# EAGLE design YAKS2-TITUO.R02.1 (EAGLE 9.1.3)
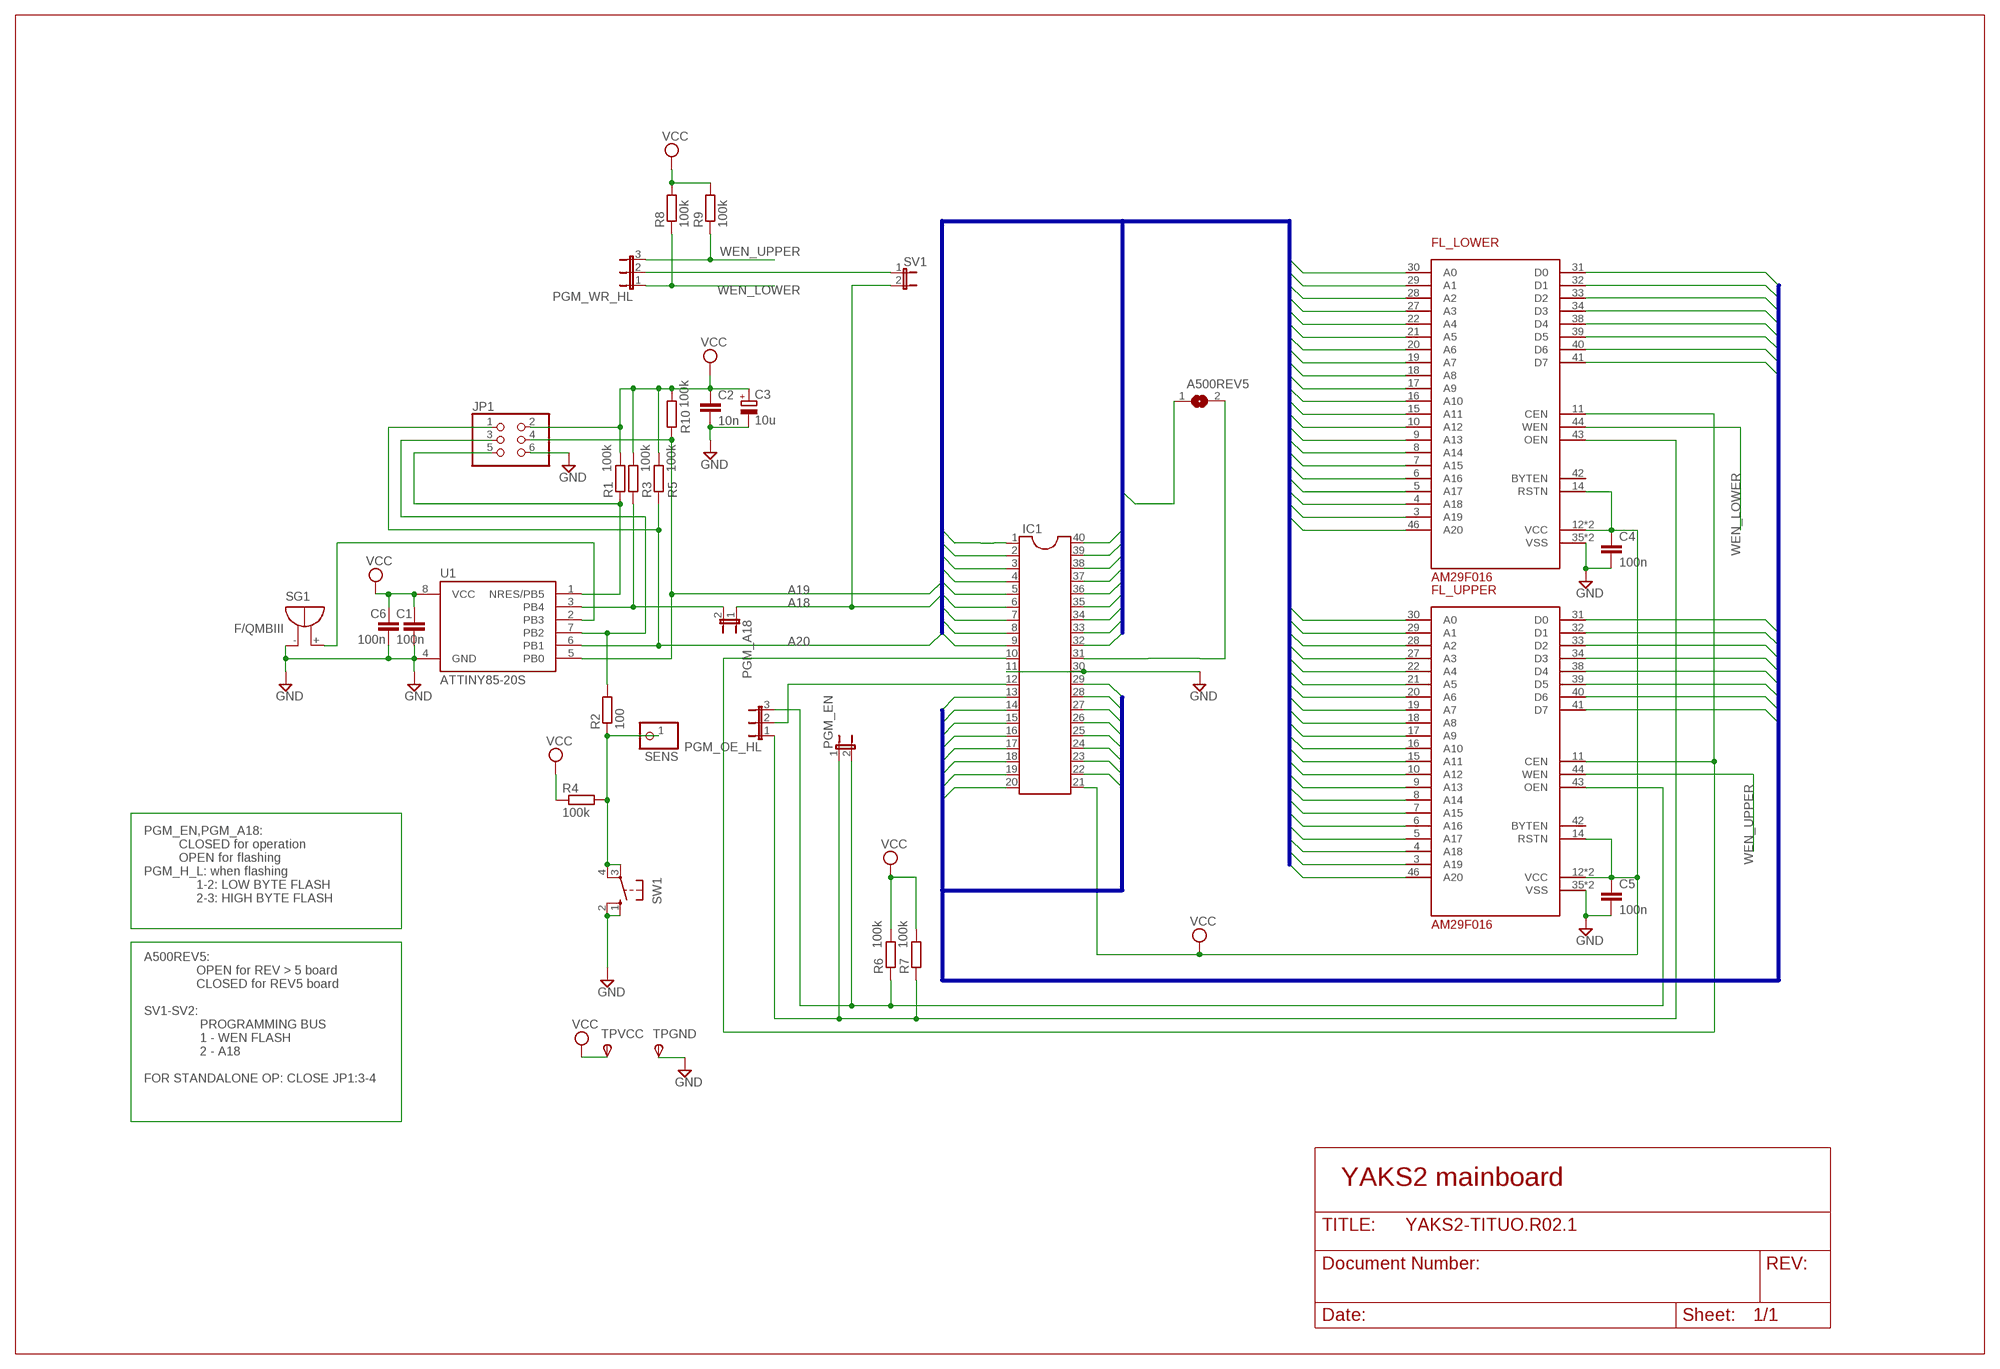
[diagram p0: schematic, sheet 1]

## Parts
A500REV5  SJ  [SJ]
C1  100n  C-EUC0805  [C0805]
C2  10n  C-EUC0805K  [C0805K]
C3  10u  CPOL-EUB/3528-21R  [B/3528-21R]
C4  100n  C-EUC0805  [C0805]
C5  100n  C-EUC0805  [C0805]
C6  100n  C-EUC0805  [C0805]
FL_LOWER  AM29F016  [TSOP48]
FL_UPPER  AM29F016  [TSOP48]
IC1  DIL40  [DIL40]
JP1  PINHD-2X3  [2X03]
PGM_A18  JP1E  [JP1]
PGM_EN  JP1E  [JP1]
PGM_OE_HL  JP2E  [JP2]
PGM_WR_HL  JP2E  [JP2]
R1  100k  R-EU_M0805  [M0805]
R2  100  R-EU_M0805  [M0805]
R3  100k  R-EU_M0805  [M0805]
R4  100k  R-EU_M0805  [M0805]
R5  100k  R-EU_M0805  [M0805]
R6  100k  R-EU_M0805  [M0805]
R7  100k  R-EU_M0805  [M0805]
R8  100k  R-EU_M0805  [M0805]
R9  100k  R-EU_M0805  [M0805]
R10  100k  R-EU_M0805  [M0805]
SENS  PINHD-1X1  [1X01]
SG1  F/QMBIII  [F/QMBIII]
SV1  JP1E  [JP1]
SW1  10-XX  [B3F-10XX]
TPGND  TPSPAD1-13  [P1-13]
TPVCC  TPSPAD1-13  [P1-13]
U1  ATTINY85-20S  [SOIC8_EIAJ_208MIL]

## Nets
A0: FL_LOWER.30(A0) FL_UPPER.30(A0) IC1.9
A1: FL_LOWER.29(A1) FL_UPPER.29(A1) IC1.8
A2: FL_LOWER.28(A2) FL_UPPER.28(A2) IC1.7
A3: FL_LOWER.27(A3) FL_UPPER.27(A3) IC1.6
A4: FL_LOWER.22(A4) FL_UPPER.22(A4) IC1.5
A5: FL_LOWER.21(A5) FL_UPPER.21(A5) IC1.4
A6: FL_LOWER.20(A6) FL_UPPER.20(A6) IC1.3
A7: FL_LOWER.19(A7) FL_UPPER.19(A7) IC1.2
A8: FL_LOWER.18(A8) FL_UPPER.18(A8) IC1.40
A9: FL_LOWER.17(A9) FL_UPPER.17(A9) IC1.39
A10: FL_LOWER.16(A10) FL_UPPER.16(A10) IC1.38
A11: FL_LOWER.15(A11) FL_UPPER.15(A11) IC1.37
A12: FL_LOWER.10(A12) FL_UPPER.10(A12) IC1.36
A13: FL_LOWER.9(A13) FL_UPPER.9(A13) IC1.35
A14: FL_LOWER.8(A14) FL_UPPER.8(A14) IC1.34
A15: FL_LOWER.7(A15) FL_UPPER.7(A15) IC1.33
A16: FL_LOWER.6(A16) FL_UPPER.6(A16) IC1.32
A17: A500REV5.1 FL_LOWER.5(A17) FL_UPPER.5(A17) IC1.1
A18: FL_LOWER.4(A18) FL_UPPER.4(A18) PGM_A18.1 SV1.2
A19: FL_LOWER.3(A19) FL_UPPER.3(A19) JP1.4 R10.1 U1.5(PB0)
A20: FL_LOWER.46(A20) FL_UPPER.46(A20) JP1.1 R5.1 U1.6(PB1)
BUZZ: SG1.+(-) U1.2(PB3)
D0: FL_LOWER.31(D0) IC1.13
D1: FL_LOWER.32(D1) IC1.15
D2: FL_LOWER.33(D2) IC1.17
D3: FL_LOWER.34(D3) IC1.19
D4: FL_LOWER.38(D4) IC1.22
D5: FL_LOWER.39(D5) IC1.24
D6: FL_LOWER.40(D6) IC1.26
D7: FL_LOWER.41(D7) IC1.28
D8: FL_UPPER.31(D0) IC1.14
D9: FL_UPPER.32(D1) IC1.16
D10: FL_UPPER.33(D2) IC1.18
D11: FL_UPPER.34(D3) IC1.20
D12: FL_UPPER.38(D4) IC1.23
D13: FL_UPPER.39(D5) IC1.25
D14: FL_UPPER.40(D6) IC1.27
D15: FL_UPPER.41(D7) IC1.29
GND: C1.2 C2.2 C3.- C4.2 C5.2 C6.2 FL_LOWER.35(VSS) FL_LOWER.36(VSS) FL_UPPER.35(VSS) FL_UPPER.36(VSS) IC1.11 IC1.30 JP1.6 SG1.-(+) SW1.1(S) SW1.2(S1) TPGND.TP(PP) U1.4(GND)
N$1: JP1.5 R1.1 U1.1(NRES/PB5)
N$2: PGM_WR_HL.2 SV1.1
N$3: A500REV5.2 IC1.31
N$6: R2.1 R4.2 SENS.1 SW1.3(P) SW1.4(P1)
N$7: IC1.12 PGM_OE_HL.2
N$15: PGM_A18.2 R3.1 U1.3(PB4)
OEN_LOWER: FL_LOWER.43(OEN) PGM_EN.1 PGM_OE_HL.1 R7.1
OEN_UPPER: FL_UPPER.43(OEN) PGM_EN.2 PGM_OE_HL.3 R6.1
ROM_ENABLE: FL_LOWER.11(CEN) FL_UPPER.11(CEN) IC1.10
SCK/PB2: JP1.3 R2.2 U1.7(PB2)
VCC: C1.1 C2.1 C3.+ C4.1 C5.1 C6.1 FL_LOWER.12(VCC) FL_LOWER.14(RSTN) FL_LOWER.37(VCC) FL_UPPER.12(VCC) FL_UPPER.14(RSTN) FL_UPPER.37(VCC) IC1.21 JP1.2 R1.2 R3.2 R4.1 R5.2 R6.2 R7.2 R8.2 R9.2 R10.2 TPVCC.TP(PP) U1.8(VCC)
WEN_LOWER: FL_LOWER.44(WEN) PGM_WR_HL.1 R8.1
WEN_UPPER: FL_UPPER.44(WEN) PGM_WR_HL.3 R9.1
Unconnected: FL_LOWER.42(BYTEN) FL_UPPER.42(BYTEN)

## Buses
A[0..20]
D[0..15]

## Notes on the sheet
- PGM_EN,PGM_A18: 
            CLOSED for operation 
            OPEN for flashing
  PGM_H_L: when flashing
                 1-2: LOW BYTE FLASH
                 2-3: HIGH BYTE FLASH
- A500REV5: 
                 OPEN for REV > 5 board
                 CLOSED for REV5 board
  
  SV1-SV2:
                  PROGRAMMING BUS
                  1 - WEN FLASH
                  2 - A18
  
  FOR STANDALONE OP: CLOSE JP1:3-4
- YAKS2 mainboard

## Library data of the parts
A500REV5 = jumper:SJ: SMD solder JUMPER
C1 C2 C4-C6 = resistor:C-EU: CAPACITOR, European symbol
C3 = rcl:CPOL-EU: POLARIZED CAPACITOR, European symbol; SPICEPREFIX: C
FL_LOWER FL_UPPER = flashmemory:AM29F016
IC1 = ic-package:DIL40: Dual In Line
JP1 = pinhead:PINHD-2X3: PIN HEADER
PGM_A18 PGM_EN SV1 = jumper:JP1E: JUMPER
PGM_OE_HL PGM_WR_HL = jumper:JP2E: JUMPER
R1-R10 = resistor:R-EU_: RESISTOR, European symbol
SENS = pinhead:PINHD-1X1: PIN HEADER
SG1 = buzzer:F/QMBIII: BUZZER Source: Buerklin; OC_FARNELL: unknown; OC_NEWARK: unknown
SW1 = buttons:10-XX: OMRON SWITCH
TPGND TPVCC = testpad:TPS: TEST PIN
U1 = _hhn_attiny25_45_85:ATTINY85*: ATMEL ATtiny 85 Packages: P = PDIP 08 30mil S = SOIC 08 EIAJ 208mil Technologies Note: for complete ordering code (temp. range, finish, tape&reel etc.) see www.atmel.com • Supply Voltage: V = (1.8…5.5)V | [blank] = (2.7…5.5)V • Speed: 10 = 10 MHz | 20 = 20 MHz Author: Dipl.-Ing. FH Rainer Bayer HHN Hochschule Heilbronn (Heilbronn University), rainer.bayer@hs-heilbronn.de Ingenieurbüro ing-rb, mail@ing-rb.de

## Board
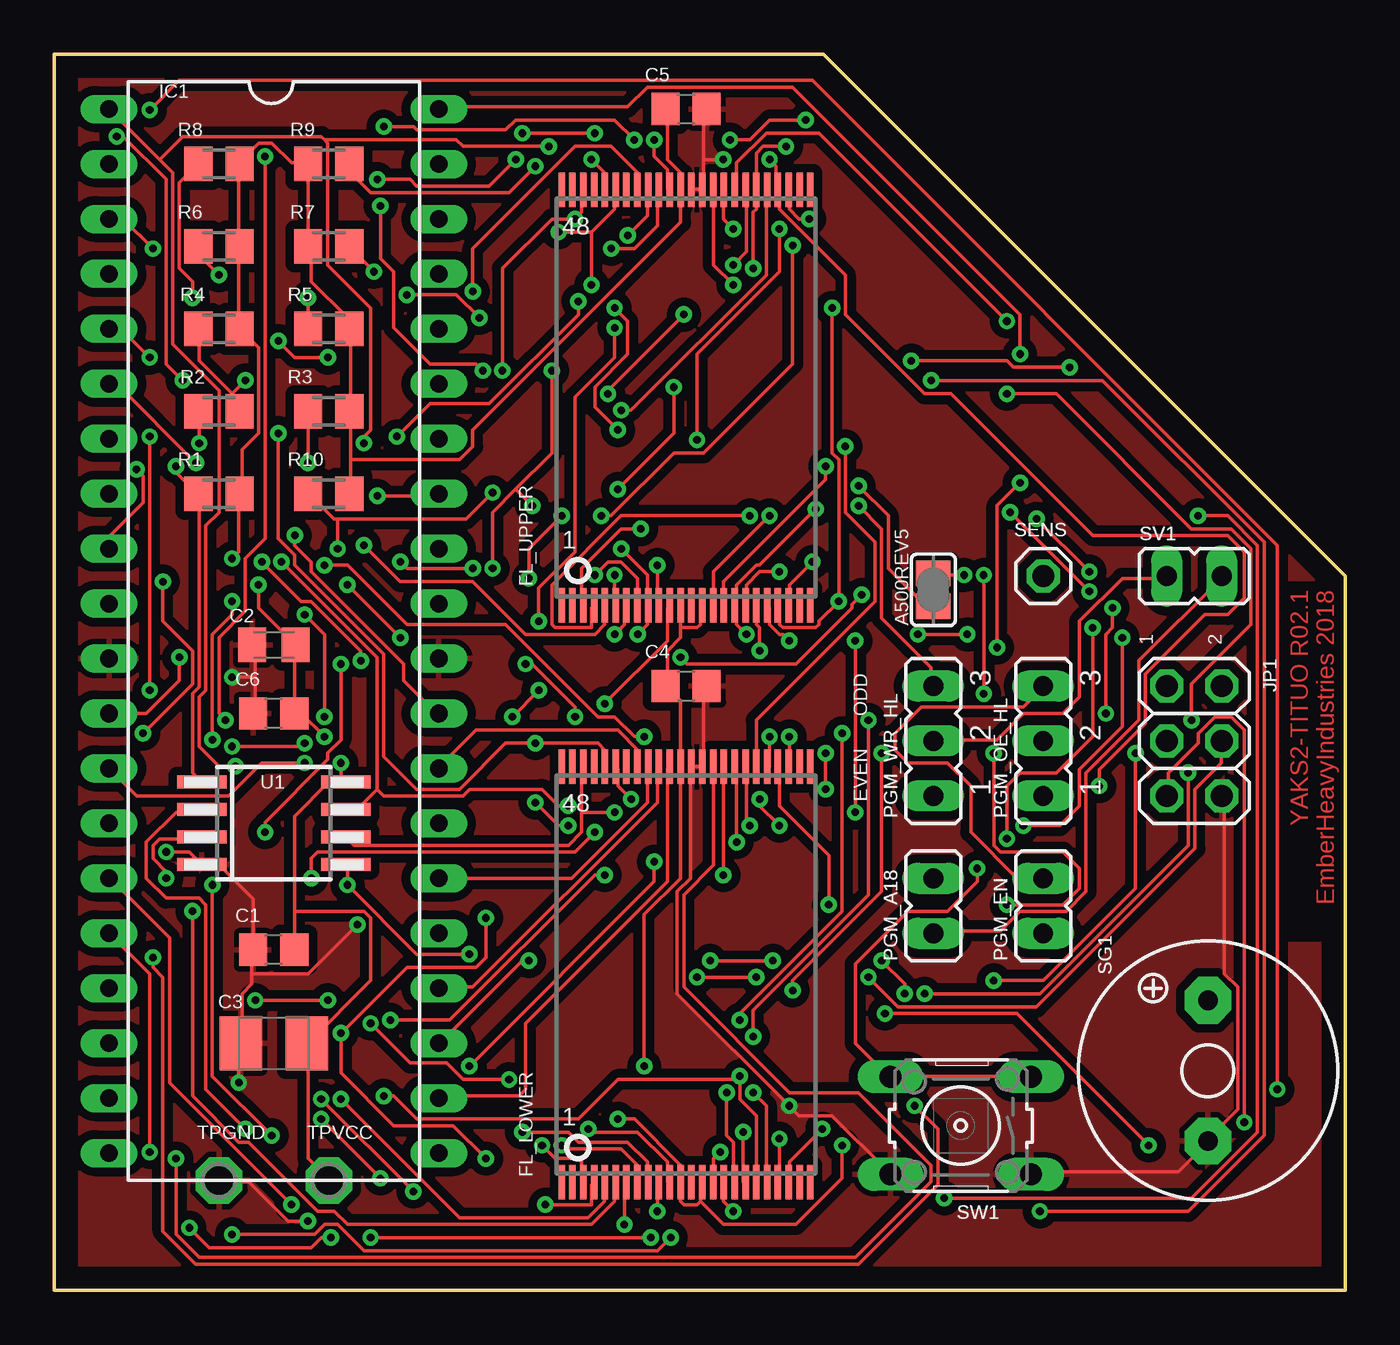
[diagram p1: board, top side]
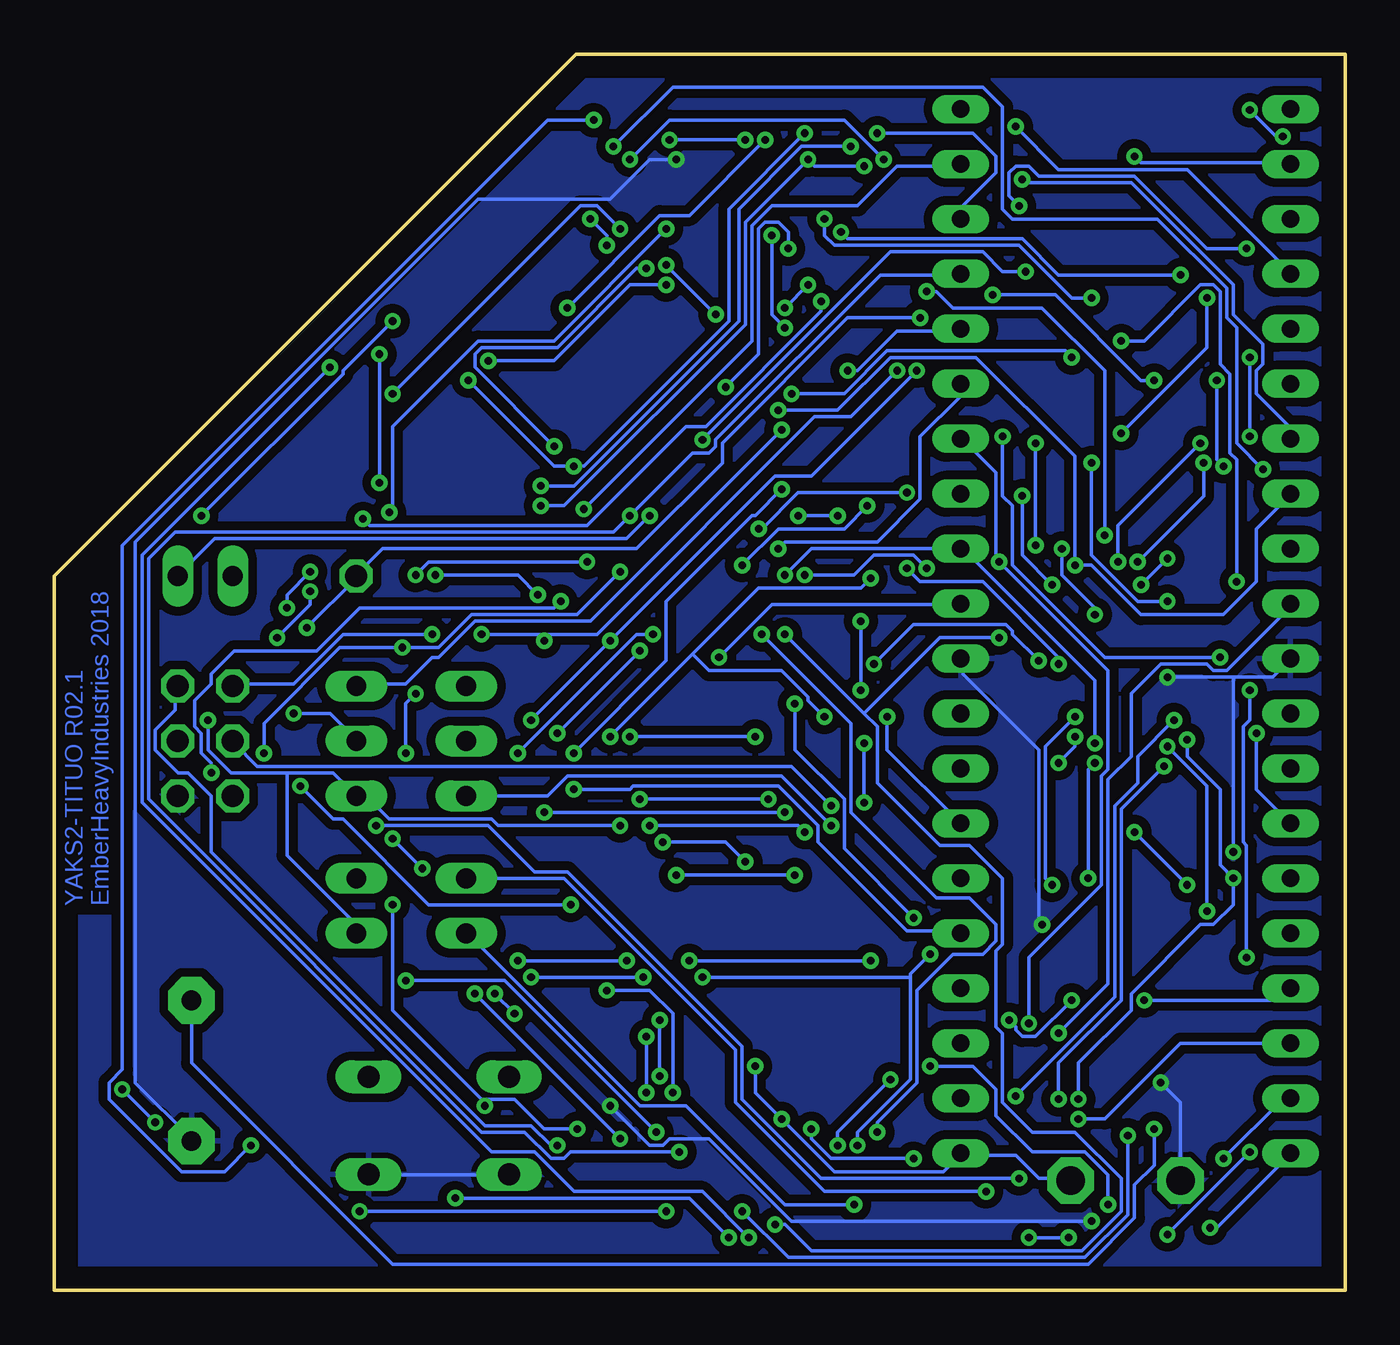
[diagram p2: board, bottom side, seen from below]

Size 59.69 x 57.15 mm. Coordinates in mm from the lower left corner, seen from the top.
Outline: 0,0 0,57.15 35.56,57.15 59.69,33.02 59.69,0 0,0
Copper layers (1*16): Top 0.035mm / dielectric 1.5mm / Bottom 0.035mm
Design rules "default": minimum track width 6mil, minimum drill 0.35mm, track to track 6mil, track to pad 6mil, pad to pad 6mil, via to via 6mil, smd to smd 6mil, copper to edge 40mil, drill to drill 6mil, minimum pad ring 10mil, minimum via ring 8mil, stop-mask expansion 4mil, vias tented up to drill 0mil, thermal gap 10mil

### Footprints (pad centres in the part's own frame; a part is rotated, then mirrored left to right if it is on the bottom)
SJ = smd 1.168 x 1.6: 1 -0.762,0; 2 0.762,0
C0805 = smd 1.3 x 1.5: 1 -0.95,0; 2 0.95,0
C0805K = smd 1.3 x 1.6: 1 -1,0; 2 1,0
B/3528-21R = smd 1.95 x 2.5: + 1.525,0; - -1.525,0
TSOP48 = smd 1.6 x 0.3: 1 -9.6,5.75; 2 -9.6,5.25; 3 -9.6,4.75; 4 -9.6,4.25; 5 -9.6,3.75; 6 -9.6,3.25; 7 -9.6,2.75; 8 -9.6,2.25; 9 -9.6,1.75; 10 -9.6,1.25; 11 -9.6,0.75; 12 -9.6,0.25; 13 -9.6,-0.25; 14 -9.6,-0.75; 15 -9.6,-1.25; 16 -9.6,-1.75; 17 -9.6,-2.25; 18 -9.6,-2.75; 19 -9.6,-3.25; 20 -9.6,-3.75; 21 -9.6,-4.25; 22 -9.6,-4.75; 23 -9.6,-5.25; 24 -9.6,-5.75; 25 9.6,-5.75; 26 9.6,-5.25; 27 9.6,-4.75; 28 9.6,-4.25; 29 9.6,-3.75; 30 9.6,-3.25; 31 9.6,-2.75; 32 9.6,-2.25; 33 9.6,-1.75; 34 9.6,-1.25; 35 9.6,-0.75; 36 9.6,-0.25; 37 9.6,0.25; 38 9.6,0.75; 39 9.6,1.25; 40 9.6,1.75; 41 9.6,2.25; 42 9.6,2.75; 43 9.6,3.25; 44 9.6,3.75; 45 9.6,4.25; 46 9.6,4.75; 47 9.6,5.25; 48 9.6,5.75
DIL40 = drill 0.813 long: 1 -24.13,-7.62; 2 -21.59,-7.62; 3 -19.05,-7.62; 4 -16.51,-7.62; 5 -13.97,-7.62; 6 -11.43,-7.62; 7 -8.89,-7.62; 8 -6.35,-7.62; 9 -3.81,-7.62; 10 -1.27,-7.62; 11 1.27,-7.62; 12 3.81,-7.62; 13 6.35,-7.62; 14 8.89,-7.62; 15 11.43,-7.62; 16 13.97,-7.62; 17 16.51,-7.62; 18 19.05,-7.62; 19 21.59,-7.62; 20 24.13,-7.62; 21 24.13,7.62; 22 21.59,7.62; 23 19.05,7.62; 24 16.51,7.62; 25 13.97,7.62; 26 11.43,7.62; 27 8.89,7.62; 28 6.35,7.62; 29 3.81,7.62; 30 1.27,7.62; 31 -1.27,7.62; 32 -3.81,7.62; 33 -6.35,7.62; 34 -8.89,7.62; 35 -11.43,7.62; 36 -13.97,7.62; 37 -16.51,7.62; 38 -19.05,7.62; 39 -21.59,7.62; 40 -24.13,7.62
2X03 = drill 1.016 octagon: 1 -2.54,-1.27; 2 -2.54,1.27; 3 0,-1.27; 4 0,1.27; 5 2.54,-1.27; 6 2.54,1.27
JP1 = drill 0.914 long: 1 0,-1.27; 2 0,1.27
JP2 = drill 0.914 long: 1 -2.54,0; 2 0,0; 3 2.54,0
M0805 = smd 1.3 x 1.6: 1 -0.95,0; 2 0.95,0
1X01 = drill 1.016 octagon: 1 0,0
F/QMBIII = drill 0.914 pad 2.159 octagon: + 3.251,0; - -3.251,0
B3F-10XX = drill 1.016 long: 1 -3.251,2.261; 2 3.251,2.261; 3 -3.251,-2.261; 4 3.251,-2.261
P1-13 = drill 1.321 pad 2.159 octagon: TP 0,0
SOIC8_EIAJ_208MIL = smd 0.6 x 2.286: 1 -1.905,-3.33; 2 -0.635,-3.33; 3 0.635,-3.33; 4 1.905,-3.33; 5 1.905,3.33; 6 0.635,3.33; 7 -0.635,3.33; 8 -1.905,3.33

### Placement (x,y rotation side)
A500REV5  40.64,32.38 90 top
C1  10.16,15.75 180 top
C2  10.16,29.84 180 top
C3  10.16,11.43 0 top
C4  29.21,27.94 0 top
C5  29.21,54.61 0 top
C6  10.16,26.67 180 top
FL_LOWER  29.21,14.61 90 top
FL_UPPER  29.21,41.28 90 top
IC1  10.16,30.48 270 top
JP1  52.7,25.4 270 top
PGM_A18  40.64,17.78 0 top
PGM_EN  45.72,17.78 0 top
PGM_OE_HL  45.72,25.4 90 top
PGM_WR_HL  40.64,25.4 90 top
R1  7.62,36.83 0 top
R2  7.62,40.64 180 top
R3  12.7,40.64 0 top
R4  7.62,44.45 180 top
R5  12.7,44.45 0 top
R6  7.62,48.26 0 top
R7  12.7,48.26 180 top
R8  7.62,52.07 0 top
R9  12.7,52.07 180 top
R10  12.7,36.83 0 top
SENS  45.72,33.02 0 top
SG1  53.34,10.16 90 top
SV1  52.7,33.02 270 top
SW1  41.91,7.62 180 top
TPGND  7.62,5.08 0 top
TPVCC  12.7,5.08 0 top
U1  10.16,21.59 270 top

### Tracks (layer width: path | path; a pad name or v marks a point on that pad's centre or on a via)
A0  (via drill 0.35)
  Top 0.152: v36.58,39.01 36.58,35.97 37.95,34.59 37.95,31.85 32.46,26.37 32.46,24.23 FL_LOWER.30 | v32.31,47.24 32.31,49.83 32.46,49.99 32.46,50.75 FL_UPPER.30 32.46,50.9 32.46,52.58 32.77,52.88 v33.83,52.88 | v3.81,37.95 4.12,37.64 4.12,36.42 2.59,34.9 2.59,34.29 IC1.9
  Bottom 0.152: v36.58,39.01 40.23,42.67 40.23,43.28 39.93,43.59 36.42,43.59 32.77,47.24 v32.31,47.24 | v3.81,37.95 5.03,39.17 5.03,44.5 5.49,44.96 5.49,46.33 8.69,49.53 15.39,49.53 15.85,49.99 15.85,54.71 16.76,55.63 31.09,55.63 v33.83,52.88
A1  (via drill 0.35)
  Top 0.152: v33.07,25.6 33.07,24.23 FL_LOWER.29 | v27.28,25.6 26.82,25.6 25.91,26.52 25.15,26.52 20.88,30.79 16.31,30.79 13.56,33.53 v12.5,33.53 | v26.21,40.69 26.67,40.69 32.92,46.94 32.92,50.75 FL_UPPER.29
  Bottom 0.152: v27.28,25.6 v33.07,25.6 | IC1.8 2.59,36.73 4.12,35.2 4.12,32.77 5.64,31.24 9.45,31.24 11.73,33.53 v12.5,33.53 12.5,38.56 17.07,43.13 21.03,43.13 23.47,40.69 v26.21,40.69
A2  (via drill 0.35)
  Top 0.152: v35.81,17.83 35.81,20.12 33.53,22.4 33.53,24.08 FL_LOWER.28 | v48.31,23.32 48.31,24.08 50.44,26.21 50.44,28.5 53.19,31.24 54.25,31.24 55.02,32 55.02,34.14 54.25,34.9 48.01,34.9 41.45,41.45 40.23,41.45 36.58,45.11 36.58,46.94 33.53,49.99 33.53,50.75 FL_UPPER.28 33.38,50.9 33.38,51.97 v33.07,52.27 | v14.94,51.36 16.46,51.36 16.76,51.05 20.12,51.05 v21.34,52.27
  Bottom 0.152: v35.81,17.83 42.37,17.83 46.33,21.79 46.79,21.79 v48.31,23.32 | v14.94,51.36 14.78,51.21 9.91,51.21 5.18,46.48 5.18,45.11 3.81,43.74 3.81,42.82 4.12,42.52 4.12,41.45 2.59,39.93 2.59,39.47 IC1.7 | v21.34,52.27 23.16,54.1 31.24,54.1 v33.07,52.27
A3  (via drill 0.35)
  Top 0.152: v33.98,25.6 33.98,24.23 FL_LOWER.27 | v21.95,32.92 21.95,34.29 v23.47,35.81 | v25.3,35.81 25.76,35.81 28.65,38.71 30.02,38.71 34.14,42.82 v34.14,48.31 | v34.9,49.53 34.44,49.53 33.98,49.99 33.98,50.75 FL_UPPER.27 | v6.55,38.25 2.9,41.91 2.59,41.91 IC1.6 | v9.6,33.68 11.43,31.85 11.89,31.85 14.17,29.57 v14.17,29.11 | v21.79,28.96 22.1,28.96 24.08,26.98 v24.08,26.52
  Bottom 0.152: 30.18,29.41 27.13,32.46 22.4,32.46 v21.95,32.92 | 30.18,29.41 v33.98,25.6 | v25.3,35.81 v23.47,35.81 | v34.14,48.31 34.14,48.77 v34.9,49.53 | v6.55,38.25 6.55,36.73 v9.6,33.68 | v14.17,29.11 15.39,30.33 15.39,30.48 15.7,30.79 19.96,30.79 v21.79,28.96 | v24.08,26.52 24.84,27.28 24.84,27.43 26.06,28.65 29.41,28.65 30.18,29.41
A4  (via drill 0.35)
  Top 0.152: v35.51,7.47 33.98,5.94 33.98,5.03 FL_LOWER.22 | v44.04,17.83 46.63,17.83 47.4,18.59 47.4,19.51 46.63,20.27 43.74,20.27 43.43,20.57 v43.43,24.84 | v42.98,33.07 v42.98,27.58 | v35.05,33.68 33.98,32.61 33.98,31.7 FL_UPPER.22 | v4.42,43.13 3.2,44.35 2.59,44.35 IC1.5 | v4.42,27.74 v4.42,39.47 | v4.57,15.39 4.57,14.94 5.03,14.48 5.03,2.74 6.55,1.22 37.19,1.22 40.84,4.88 40.84,7.47 v39.78,8.53
  Bottom 0.152: v35.51,7.47 37.03,7.47 38.41,8.84 39.78,8.84 | 39.78,8.84 39.93,8.84 44.04,12.95 v44.04,17.83 | v43.43,24.84 43.43,27.13 v42.98,27.58 | v42.98,33.07 42.37,33.68 v35.05,33.68 | v4.42,39.47 v4.42,43.13 | v4.42,27.74 4.42,26.37 4.72,26.06 4.72,20.73 4.57,20.57 v4.57,15.39 | 39.78,8.84 v39.78,8.53
A5  (via drill 0.35)
  Top 0.152: v33.53,7.01 33.53,5.03 FL_LOWER.21 | v40.23,13.72 45.57,13.72 52.43,20.57 v52.43,23.93 | FL_UPPER.21 33.53,31.55 33.53,30.79 33.68,30.63 35.2,30.63 35.36,30.79 35.36,30.94 v36.27,31.85 36.27,38.41 35.97,38.71 v35.97,45.42 | v15.24,53.8 16.61,53.8 16.76,53.64 20.88,53.64 21.34,54.1 25.91,54.1 v26.82,53.19
  Bottom 0.152: v40.23,13.72 v33.53,7.01 | v52.43,23.93 52.43,24.38 52.88,24.84 52.88,25.76 53.19,26.06 53.19,27.28 52.43,28.04 52.43,28.5 51.36,29.57 47.55,29.57 45.57,31.55 36.58,31.55 v36.27,31.85 | v15.24,53.8 13.26,51.82 7.32,51.82 2.59,47.09 IC1.4 | v26.82,53.19 30.33,49.68 31.7,49.68 v35.97,45.42
A6  (via drill 0.35)
  Top 0.152: v32.31,9.14 32.92,8.53 32.92,5.03 FL_LOWER.20 | v32.31,11.73 32.31,12.95 37.64,18.29 v37.64,26.37 | v33.98,30.02 33.68,30.33 33.53,30.33 33.07,30.79 33.07,31.55 FL_UPPER.20 | v4.57,48.16 3.2,49.53 2.59,49.53 IC1.3 | v15.09,50.14 15.09,47.7 15.7,47.09 15.7,44.5 17.37,42.82 19.51,42.82 v19.81,42.52
  Bottom 0.152: v32.31,11.73 v32.31,9.14 | v37.64,26.37 v33.98,30.02 26.36,37.64 24.69,37.64 v19.81,42.52 | v4.57,48.16 6.4,48.16 9.75,51.51 14.17,51.51 14.63,51.97 15.24,51.97 15.54,51.66 15.54,50.6 v15.09,50.14
A7  (via drill 0.35)
  Top 0.152: 31.7,9.75 v31.7,9.91 31.7,9.75 | 31.7,9.75 31.7,8.84 32.46,8.08 32.46,5.03 FL_LOWER.19 | v31.7,12.5 31.7,12.8 36.42,17.53 v36.42,25.76 | v32.61,29.57 32.61,30.63 32.46,30.79 32.46,31.55 FL_UPPER.19 | v9.75,52.43 9.75,34.75 8.84,33.83 8.84,31.39 7.62,30.17 7.62,26.67 v7.92,26.37 | v15.24,8.99 15.7,8.99 16.76,7.93 24.23,7.93 26.06,9.75 31.7,9.75
  Bottom 0.152: v31.7,12.5 v31.7,9.91 | v32.61,29.57 v36.42,25.76 | v9.75,52.43 9.45,52.12 2.59,52.12 IC1.2 | v7.92,26.37 9.6,24.69 9.6,23.47 10.67,22.4 10.67,13.56 v15.24,8.99
A8  (via drill 0.35)
  Top 0.152: v31.85,7.32 31.85,5.03 FL_LOWER.18 | v43.43,14.33 45.72,14.33 49.99,18.59 v49.99,24.84 | v33.53,33.22 32.61,33.22 32,32.61 32,31.7 FL_UPPER.18 | v44.65,43.28 44.65,45.11 34.14,55.63 27.43,55.63 26.52,54.71 17.83,54.71 IC1.40 | v44.65,37.34 43.59,36.27 v43.59,29.72
  Bottom 0.152: v31.85,7.32 38.86,14.33 v43.43,14.33 | v49.99,24.84 49.99,26.21 46.48,29.72 v43.59,29.72 41.91,29.72 40.39,31.24 35.51,31.24 v33.53,33.22 | v44.65,37.34 v44.65,43.28
A9  (via drill 0.35)
  Top 0.152: v31.09,9.14 31.09,7.16 31.39,6.86 31.39,5.03 FL_LOWER.17 | v34.14,13.87 34.14,14.33 38.25,18.44 v38.25,24.84 | v32,30.33 31.55,30.79 31.55,31.55 FL_UPPER.17 31.55,31.7 31.55,32.61 32.46,33.53 32.61,33.53 v35.2,36.12
  Bottom 0.152: v31.09,9.14 31.09,12.8 32.16,13.87 v34.14,13.87 | v38.25,24.84 32.77,30.33 v32,30.33 | v35.2,36.12 27.43,43.89 27.43,49.22 26.52,50.14 22.55,50.14 20.73,51.97 17.83,51.97 IC1.39
A10  (via drill 0.35)
  Top 0.152: v31.39,3.66 30.94,4.12 30.94,4.88 FL_LOWER.16 | v45.57,3.66 52.43,3.66 55.93,7.16 55.93,34.59 48.46,42.06 v40.54,42.06 | v35.66,38.1 35.66,37.49 30.94,32.77 30.94,31.7 FL_UPPER.16 | v24.99,53.49 v21.64,53.49
  Bottom 0.152: v45.57,3.66 v31.39,3.66 | v40.54,42.06 36.58,38.1 v35.66,38.1 35.2,38.1 28.5,44.81 28.5,49.99 v24.99,53.49 | v21.64,53.49 17.22,53.49 16.15,52.43 16.15,51.66 17.68,50.14 17.68,49.53 IC1.38
A11  (via drill 0.35)
  Top 0.152: v30.79,6.4 30.48,6.1 30.48,5.03 FL_LOWER.15 | v33.07,35.81 30.48,33.22 30.48,31.7 FL_UPPER.15
  Bottom 0.152: v30.79,6.4 35.81,6.4 36.12,6.1 36.73,6.1 37.95,7.32 39.93,7.32 55.32,22.71 55.32,33.83 54.1,35.05 33.83,35.05 v33.07,35.81 30.18,38.71 29.41,38.71 29.11,39.01 29.11,39.32 21.49,46.94 17.83,46.94 IC1.37
A12  (via drill 0.35)
  Top 0.152: v27.89,3.66 27.89,4.88 FL_LOWER.10 | v10.06,7.16 7.32,9.91 v7.32,18.74 | v9.75,21.18 9.75,21.64 12.65,24.54 12.65,24.84 13.26,25.45 v13.26,28.96 | v20.27,33.38 20.27,35.97 21.34,37.03 | 21.34,37.03 23.01,38.71 v23.01,42.52 | v27.89,33.53 27.89,31.7 FL_UPPER.10 | 21.34,37.03 v22.1,36.27
  Bottom 0.152: v27.89,3.66 25.76,1.52 12.04,1.52 10.06,3.5 v10.06,7.16 | v9.75,21.18 v7.32,18.74 | v13.26,28.96 13.26,29.26 16.76,32.77 19.66,32.77 v20.27,33.38 | v23.01,42.52 22.55,42.52 20.73,44.35 17.83,44.35 IC1.36 | v27.89,33.53 26.21,35.2 23.16,35.2 v22.1,36.27
A13  (via drill 0.35)
  Top 0.152: v21.64,7.32 23.77,7.32 24.23,6.86 26.52,6.86 27.43,5.94 27.43,5.03 FL_LOWER.9 | v26.98,30.33 27.43,30.79 27.43,31.55 FL_UPPER.9 27.43,31.7 27.43,33.07 v26.21,34.29
  Bottom 0.152: v21.64,7.32 21.64,7.77 19.81,9.6 19.81,13.87 18.14,15.55 16.76,15.55 16.15,16.15 16.15,16.92 17.37,18.14 18.9,18.14 22.86,22.1 22.86,26.21 v26.98,30.33 | v26.21,34.29 25.91,34.59 21.64,34.59 19.66,36.58 19.66,39.47 17.83,41.3 17.83,41.91 IC1.35
A14  (via drill 0.35)
  Top 0.152: v23.47,6.71 23.62,6.55 26.21,6.55 26.98,5.79 26.98,5.03 FL_LOWER.8 | v21.03,9.75 18.9,9.75 18.14,10.52 16.46,10.52 v14.63,12.34 | v24.99,33.07 25.6,33.68 26.21,33.68 26.98,32.92 26.98,31.7 FL_UPPER.8 | v19.36,33.38 16.31,33.38 v16,33.68
  Bottom 0.152: v23.47,6.71 23.47,7.32 v21.03,9.75 | v14.63,12.34 14.63,15.39 11.28,18.74 11.28,23.77 10.97,24.08 10.97,28.65 v16,33.68 16.15,33.83 16.15,37.8 17.68,39.32 IC1.34 | v24.99,33.07 22.71,33.07 21.79,33.98 19.96,33.98 v19.36,33.38
A15  (via drill 0.35)
  Top 0.152: v26.36,3.05 26.36,4.88 FL_LOWER.7 | v25.91,30.33 26.36,30.79 26.36,31.55 FL_UPPER.7 | v14.94,36.73 17.68,36.73 IC1.33 | v16,30.17 v13.56,32.61
  Bottom 0.152: v26.36,3.05 25.91,3.05 24.69,1.83 12.19,1.83 10.36,3.66 10.36,5.18 12.5,7.32 14.48,7.32 15.85,8.69 15.85,11.89 16.15,12.19 16.15,15.7 15.85,16 15.85,19.05 17.37,20.57 18.75,20.57 21.64,23.47 21.64,26.06 22.25,26.67 | v25.91,30.33 22.25,26.67 | v14.94,36.73 14.94,33.98 v13.56,32.61 | v16,30.17 18.75,30.17 22.25,26.67
A16  (via drill 0.35)
  Top 0.152: v6.4,17.53 6.4,8.99 8.53,6.86 8.99,6.86 12.19,3.66 12.95,3.66 13.56,3.05 24.84,3.05 25.91,4.12 25.91,4.88 FL_LOWER.6 | v8.23,25.15 11.43,25.15 v11.58,25.3 | v25.91,33.07 25.91,31.7 FL_UPPER.6
  Bottom 0.152: v6.4,17.53 6.4,23.32 v8.23,25.15 | v11.58,25.3 11.58,28.19 17.68,34.29 IC1.32 17.83,34.29 24.69,34.29 v25.91,33.07
A17  (via drill 0.35)
  Top 0.152: v13.26,8.84 18.75,3.35 24.69,3.35 25.45,4.12 25.45,4.88 FL_LOWER.5 | v8.38,24.23 7.62,24.23 6.71,25.15 6.71,27.43 7.01,27.74 7.01,35.36 7.62,35.97 7.62,41.61 5.49,43.74 5.49,51.66 4.88,52.27 | 4.88,52.27 2.59,54.56 IC1.1 | v14.33,34.44 16,32.77 19.36,32.77 21.79,30.33 24.99,30.33 25.45,30.79 25.45,31.55 FL_UPPER.5 | v14.33,39.17 14.33,39.47 14.63,39.78 14.63,45.42 12.65,47.4 12.65,53.03 12.5,53.19 | 12.5,53.19 12.34,53.34 5.94,53.34 4.88,52.27 | v37.19,37.19 38.56,35.81 38.56,33.38 40.23,31.7 40.54,31.7 A500REV5.1 | v22.86,52.88 18.9,52.88 18.59,53.19 12.5,53.19
  Bottom 0.152: v13.26,8.84 13.26,10.52 10.36,13.41 10.36,22.25 v8.38,24.23 | v14.33,39.17 v14.33,34.44 | v37.19,37.19 35.66,37.19 28.04,44.81 28.04,49.99 25.15,52.88 v22.86,52.88
A18  (via drill 0.35)
  Top 0.152: v22.71,3.96 24.84,3.96 24.84,4.88 FL_LOWER.4 | v32.16,35.81 26.21,35.81 23.01,32.61 23.01,30.79 23.16,30.63 24.84,30.63 24.84,31.55 FL_UPPER.4 | PGM_A18.1 40.69,16.61 43.74,16.61 44.65,17.53 46.79,17.53 47.7,18.44 47.7,23.93 50.14,26.37 50.14,29.11 53.95,32.92 SV1.2
  Bottom 0.152: v22.71,3.96 25.91,3.96 30.48,8.53 32.61,8.53 40.54,16.46 PGM_A18.1 | v32.16,35.81 33.22,34.75 52.27,34.75 53.95,33.07 SV1.2
A19  (via drill 0.35)
  Top 0.152: 13.11,35.66 19.05,35.66 v20.27,36.88 | 13.11,35.66 12.95,35.66 11.89,36.73 R10.1 | v27.13,35.2 26.21,35.2 24.38,33.38 24.38,31.7 FL_UPPER.3 | v22.55,6.71 23.16,6.1 24.23,6.1 24.38,5.94 24.38,5.03 FL_LOWER.3 | v19.2,15.55 16.76,15.55 v13.56,18.74 13.56,19.66 U1.5 | v37.64,14.48 39.01,13.11 45.41,13.11 52.73,20.42 52.73,23.16 53.95,24.38 53.95,25.3 JP1.4 | v29.72,14.48 v32.46,14.48 | v13.11,34.29 13.11,35.66 | v11.58,31.24 12.5,30.33 v12.5,26.52
  Bottom 0.152: v20.27,36.88 25.3,36.88 26.98,35.2 v27.13,35.2 | v22.55,6.71 22.55,7.32 20.12,9.75 20.12,14.48 | 20.12,14.48 20.12,14.63 v19.2,15.55 | v32.46,14.48 v37.64,14.48 | 20.12,14.48 v29.72,14.48 | v13.11,34.29 13.11,33.07 11.58,31.55 v11.58,31.24 | v12.5,26.52 13.87,25.15 13.87,19.05 v13.56,18.74
A20  (via drill 0.35)
  Top 0.152: 24.38,22.1 24.38,21.18 23.77,20.57 13.87,20.57 13.56,20.88 U1.6 | 24.38,22.1 24.38,24.08 FL_LOWER.46 | v11.73,45.87 11.73,44.5 R5.1 | FL_UPPER.46 24.38,50.75 24.38,49.83 v24.08,49.53 23.01,49.53 20.73,47.24 v20.73,42.52 | v39.93,30.33 v42.22,30.33 | v25.91,22.1 24.38,22.1 | v37.03,30.02 v37.03,22.1
  Bottom 0.152: v11.73,45.87 12.65,45.87 15.09,48.31 23.62,48.31 24.08,48.77 v24.08,49.53 | v42.22,30.33 46.33,30.33 48.62,28.04 51.36,28.04 JP1.1 | 37.03,30.33 34.59,30.33 24.54,40.39 22.86,40.39 v20.73,42.52 | 37.03,30.33 v39.93,30.33 | v37.03,22.1 v25.91,22.1 | 37.03,30.33 v37.03,30.02
BUZZ  (via drill 0.35)
  Top 0.152: v8.84,7.47 7.01,9.3 7.01,17.83 6.71,18.14 5.18,18.14 4.27,19.05 4.27,20.73 5.64,22.1 6.71,22.1 U1.2
  Bottom 0.152: v8.84,7.47 8.84,5.79 9.75,4.88 9.75,3.35 11.89,1.22 44.04,1.22 53.34,10.52 SG1.+
D0  (via drill 0.35)
  Top 0.152: v32.16,21.49 32,21.64 32,24.08 FL_LOWER.31 | v24.99,21.18 24.08,20.27 12.19,20.27 11.89,19.96 v11.89,19.05 | v11.58,24.38 9.6,24.38 8.08,22.86 3.81,22.86 2.59,24.08 IC1.13
  Bottom 0.152: v32.16,21.49 25.3,21.49 v24.99,21.18 | v11.89,19.05 11.89,24.08 v11.58,24.38
D1  (via drill 0.35)
  Top 0.152: v31.55,20.73 31.55,24.08 FL_LOWER.32 | v27.74,19.81 27.74,18.9 v19.2,10.36 | v10.97,3.96 5.33,9.6 5.33,16.31 2.59,19.05 IC1.15
  Bottom 0.152: v31.55,20.73 28.65,20.73 v27.74,19.81 | v19.2,10.36 17.22,10.36 16.15,9.3 16.15,8.08 14.48,6.4 12.04,6.4 10.97,5.33 v10.97,3.96
D2  (via drill 0.35)
  Top 0.152: v30.94,19.2 30.94,24.08 FL_LOWER.33 | v25.45,19.2 24.99,19.2 18.29,12.5 v15.54,12.5 | v9.3,13.41 v12.65,13.41
  Bottom 0.152: v25.45,19.2 v30.94,19.2 | v15.54,12.5 15.24,12.19 15.24,12.04 14.94,11.73 14.33,11.73 v12.65,13.41 | v9.3,13.41 3.05,13.41 2.59,13.87 IC1.17
D3  (via drill 0.35)
  Top 0.152: v5.64,6.1 5.64,2.59 6.71,1.52 37.03,1.52 40.54,5.03 40.54,5.79 37.19,9.14 33.98,9.14 29.11,14.02 29.11,18.29 30.48,19.66 30.48,24.08 FL_LOWER.34
  Bottom 0.152: v5.64,6.1 2.9,8.84 2.59,8.84 IC1.19
D4
  Top 0.152: FL_LOWER.38 28.35,24.08 28.35,18.9 21.79,12.34 21.79,9.3 21.49,8.99 17.83,8.99 IC1.22
D5
  Top 0.152: FL_LOWER.39 27.89,24.08 27.89,22.55 19.36,14.02 17.83,14.02 IC1.24
D6
  Top 0.152: FL_LOWER.40 27.43,24.08 27.43,22.55 23.93,19.05 17.83,19.05 IC1.26
D7
  Top 0.152: FL_LOWER.41 26.98,24.23 26.98,24.99 26.06,25.91 19.51,25.91 17.83,24.23 IC1.28
D8  (via drill 0.35)
  Top 0.152: v31.39,47.4 32,48.01 32,50.75 FL_UPPER.31 | v29.11,45.11 25.6,41.61 v25.6,41.45 | v12.65,43.13 11.12,43.13 v10.36,43.89 | v5.03,32.77 5.03,30.94 6.4,29.57 6.4,28.04 v4.12,25.76
  Bottom 0.152: v29.11,45.11 v31.39,47.4 | v25.6,41.45 23.16,41.45 21.18,43.43 12.95,43.43 v12.65,43.13 | v10.36,43.89 9.3,43.89 6.71,46.48 6.1,46.48 5.79,46.18 5.79,42.82 5.33,42.37 5.33,38.71 5.03,38.41 v5.03,32.77 | v4.12,25.76 4.12,23.16 2.59,21.64 IC1.14
D9  (via drill 0.35)
  Top 0.152: v44.04,44.81 35.36,53.49 32.92,53.49 31.55,52.12 31.55,50.9 FL_UPPER.32 | v52.88,35.81 54.25,35.81 55.63,34.44 55.63,7.32 52.58,4.27 v41.15,4.27 | v28.5,2.44 27.89,1.83 14.33,1.83 13.11,3.05 12.5,3.05 12.04,2.59 v8.23,2.59 | v4.42,6.4 4.42,14.63 2.59,16.46 IC1.16
  Bottom 0.152: v44.04,44.81 46.33,42.52 46.33,42.37 v52.88,35.81 | v41.15,4.27 30.33,4.27 v28.5,2.44 | v4.42,6.4 v8.23,2.59
D10  (via drill 0.35)
  Top 0.152: v31.39,49.07 30.94,49.53 30.94,50.75 FL_UPPER.33 | v47.85,32.31 v44.2,35.97 | v49.38,30.17 49.38,26.06 47.4,24.08 47.4,22.4 46.48,21.49 v44.81,21.49 | v12.34,7.93 v15.09,5.18
  Bottom 0.152: v31.39,49.07 36.58,43.89 40.08,43.89 44.04,39.93 44.04,36.12 v44.2,35.97 | v47.85,32.31 47.85,31.7 v49.38,30.17 | v44.81,21.49 39.62,21.49 37.49,19.36 35.97,19.36 27.89,11.28 27.89,8.84 24.23,5.18 v15.09,5.18 | v12.34,7.93 11.12,7.93 7.62,11.43 2.59,11.43 IC1.18
D11  (via drill 0.35)
  Top 0.152: v31.39,46.48 30.48,47.4 30.48,50.75 FL_UPPER.34 | v39.62,42.98 44.04,42.98 44.35,42.67 v46.94,42.67 | v14.63,2.44 v27.58,2.44 | v12.8,2.44 12.34,2.44 11.89,1.98 7.16,1.98 v6.25,2.9
  Bottom 0.152: v31.39,46.48 33.07,46.48 36.58,42.98 v39.62,42.98 | v46.94,42.67 55.63,33.98 55.63,22.55 39.47,6.4 37.49,6.4 35.66,4.57 29.72,4.57 v27.58,2.44 | v12.8,2.44 v14.63,2.44 | v6.25,2.9 5.94,2.9 2.59,6.25 IC1.20
D12  (via drill 0.35)
  Top 0.152: v27.74,53.19 27.74,52.43 28.35,51.82 28.35,50.9 FL_UPPER.38 | v31.24,53.19 32.16,53.19 33.07,54.1 v34.75,54.1 | v50.6,6.71 44.5,12.8 v38.41,12.8 | v39.32,13.72 39.32,14.17 v38.25,15.24 | v30.33,15.24 v33.22,15.24 | v21.95,15.24 21.64,15.24 17.83,11.43 IC1.23
  Bottom 0.152: v31.24,53.19 v27.74,53.19 | v34.75,54.1 36.88,54.1 56.54,34.44 56.54,10.21 57.15,9.6 57.15,8.84 53.8,5.49 51.82,5.49 v50.6,6.71 | v39.32,13.72 v38.41,12.8 | v33.22,15.24 v38.25,15.24 | v21.95,15.24 v30.33,15.24
D13  (via drill 0.35)
  Top 0.152: v25.76,48.16 26.82,48.16 27.89,49.22 27.89,50.75 FL_UPPER.39 | v28.65,41.76 28.65,39.62 v26.06,37.03 | v35.66,23.16 v35.66,24.84
  Bottom 0.152: v25.76,48.16 25.76,48.92 26.21,49.38 26.82,49.38 27.13,49.07 27.13,43.28 v28.65,41.76 | v26.06,37.03 27.28,35.81 27.43,35.81 31.39,31.85 31.39,29.11 v35.66,24.84 | v35.66,23.16 33.07,23.16 32.92,23.32 26.21,23.32 24.38,21.49 24.38,20.73 20.27,16.61 17.83,16.61 IC1.25
D14  (via drill 0.35)
  Top 0.152: v26.52,48.77 27.43,49.68 27.43,50.75 FL_UPPER.40 | v25.91,44.5 25.91,43.13 24.08,41.3 24.08,34.14 22.4,32.46 v22.4,30.94 | v21.18,26.52 v22.4,27.74
  Bottom 0.152: v26.52,48.77 26.52,45.11 v25.91,44.5 | v22.4,27.74 v22.4,30.94 | v21.18,26.52 21.18,24.99 17.83,21.64 IC1.27
D15  (via drill 0.35)
  Top 0.152: v19.36,46.18 19.36,48.16 24.08,52.88 25.76,52.88 26.98,51.66 26.98,50.9 FL_UPPER.41 | v11.12,34.9 11.12,34.44 11.89,33.68 11.89,33.22 16.15,28.96 16.15,28.19 17.68,26.67 IC1.29
  Bottom 0.152: v19.36,46.18 18.9,46.18 18.14,45.42 14.02,45.42 11.12,42.52 v11.12,34.9
GND  (via drill 0.35)
  Top 0.152: 7.63,19.67 9.21,18.09 C1.2 9.14,15.7 9.14,14.63 | 7.63,19.67 7.62,19.69 | 9.3,28.35 9.3,29.72 C2.2 | 9.3,28.35 9.3,26.67 C6.2 | v8.23,28.35 9.3,28.35 | 7.63,19.67 7.62,19.66 6.86,19.66 U1.4 6.71,19.81 6.25,20.27 v5.18,20.27 | 9.14,14.63 9.14,14.17 8.69,13.72 8.69,11.43 C3.- 8.53,11.43 v8.53,9.6 | v14.02,16.92 11.73,14.63 9.14,14.63 | C4.2 30.02,27.89 30.02,24.23 FL_LOWER.35 29.87,24.23 29.57,24.23 FL_LOWER.36 29.41,24.08 29.41,19.05 28.8,18.44 28.8,13.72 v33.98,8.53 34.44,8.08 35.97,8.08 38.56,5.49 SW1.2 | 30.02,52.27 30.02,50.9 FL_UPPER.35 29.87,50.9 29.57,50.9 FL_UPPER.36 | 30.02,52.27 30.02,54.56 C5.2 | v30.94,52.27 30.02,52.27 | JP1.6 54.1,22.86 54.1,14.63 54.71,14.02 54.71,8.38 53.34,7.01 SG1.- 53.34,6.86 51.97,5.49 45.26,5.49 SW1.1 | v11.73,3.2 10.82,3.2 8.99,5.03 7.62,5.03 TPGND.TP
  Bottom 0.152: 5.18,28.35 3.35,28.35 2.59,29.11 IC1.11 | 5.18,28.35 v8.23,28.35 | v14.02,16.92 14.17,17.07 14.17,24.99 17.68,28.5 17.68,29.11 IC1.30 | v8.53,9.6 7.62,8.69 7.62,5.18 TPGND.TP | v5.18,20.27 5.18,28.35 | SW1.1 45.11,5.33 38.71,5.33 SW1.2 | v30.94,52.27 32.16,52.27 33.98,50.44 40.08,50.44 55.93,34.59 55.93,9.6 53.34,7.01 SG1.- | v11.73,3.2 25.6,3.2 29.41,7.01 31.24,7.01 31.55,6.71 32.16,6.71 v33.98,8.53
  pour Top (isolate 0.406): 0,57.15 35.56,57.15 59.69,33.02 59.69,0 0,0
  pour Bottom (isolate 0.406): 0,57.15 35.56,57.15 59.69,33.02 59.69,0 0,0
N$1  (via drill 0.35)
  Top 0.152: U1.1 6.71,23.62 6.4,23.93 6.4,27.58 6.71,27.89 6.71,36.73 R1.1 6.55,36.88 5.64,37.8 v5.64,38.1 | v55.02,7.77 55.02,25.91 54.41,26.52 53.65,26.52 52.88,25.76 52.88,25.3 51.51,23.93 51.51,22.86 JP1.5 | v56.54,9.3 56.54,34.44 35.05,55.93 5.79,55.93 v4.42,54.56 | v2.9,53.34 3.2,53.34 5.18,51.36 5.18,42.82 v5.94,42.06
  Bottom 0.152: v56.54,9.3 v55.02,7.77 | v4.42,54.56 3.2,53.34 v2.9,53.34 | v5.94,42.06 5.94,38.41 v5.64,38.1
N$2
  Top 0.152: PGM_WR_HL.2 40.69,25.45 43.59,25.45 44.81,26.67 46.63,26.67 47.4,27.43 47.4,30.94 49.38,32.92 51.36,32.92 SV1.1
N$3  (via drill 0.35)
  Top 0.152: v42.06,33.07 40.69,33.07 A500REV5.2 | v37.34,32.16 36.88,31.7 36.88,31.55 34.29,28.96 29.26,28.96 v28.96,29.26
  Bottom 0.152: v42.06,33.07 38.25,33.07 v37.34,32.16 | v28.96,29.26 26.52,31.7 17.83,31.7 IC1.31
N$6  (via drill 0.35)
  Top 0.152: 8.23,41.45 8.53,41.15 8.53,40.69 R2.1 | 8.23,41.45 6.71,42.98 6.71,44.35 R4.2 | SW1.3 45.11,9.91 38.71,9.91 SW1.4 38.56,9.91 37.03,11.43 37.03,15.09 39.47,17.53 41.3,17.53 42.67,18.9 v42.67,19.51 | v48.01,30.63 48.01,25.6 46.33,23.93 44.65,23.93 44.04,23.32 v44.04,20.88 | v8.84,42.06 8.23,41.45 | v16.31,46.03 18.59,46.03 v19.66,44.96
  Bottom 0.152: v48.01,30.63 45.72,32.92 SENS.1 45.72,33.07 44.5,34.29 32.77,34.29 28.8,38.25 28.8,39.17 23.01,44.96 v19.66,44.96 | v42.67,19.51 v44.04,20.88 | v8.84,42.06 9.45,42.06 13.41,46.03 v16.31,46.03
N$7  (via drill 0.35)
  Top 0.152: v5.79,29.26 5.79,28.19 4.27,26.67 2.59,26.67 IC1.12 | v15.85,39.47 17.37,41 20.12,41 24.23,45.11 v24.23,45.72 | v47.85,33.22 v45.41,35.66 | v48.92,31.55 48.92,30.63 48.62,30.33 v48.62,26.67
  Bottom 0.152: v5.79,29.26 11.12,29.26 15.39,33.53 15.39,36.27 15.85,36.73 v15.85,39.47 | v24.23,45.72 24.23,45.26 29.57,39.93 30.48,39.93 35.05,35.36 45.11,35.36 v45.41,35.66 | v47.85,33.22 48.92,32.16 v48.92,31.55 | v48.62,26.67 46.94,26.67 45.72,25.45 PGM_OE_HL.2
N$15  (via drill 0.35)
  Top 0.152: v11.73,38.25 11.73,40.54 R3.1 | v8.23,31.85 8.23,31.24 7.32,30.33 v7.32,25.45 | v5.18,19.05 5.18,19.36 4.57,19.96 4.57,20.57 4.88,20.88 6.71,20.88 U1.3 | v12.34,8.84 v16.61,4.57
  Bottom 0.152: v11.73,38.25 11.73,33.98 9.6,31.85 v8.23,31.85 | v7.32,25.45 7.32,24.69 5.79,23.16 5.79,19.66 v5.18,19.05 5.18,17.83 6.1,16.92 6.71,16.92 9.91,13.72 9.91,12.95 12.34,10.52 v12.34,8.84 | v16.61,4.57 24.08,4.57 28.19,8.69 28.19,11.12 36.12,19.05 40.54,19.05 PGM_A18.2
OEN_LOWER  (via drill 0.35)
  Top 0.152: v14.78,47.09 13.72,48.16 R7.1 | v29.72,39.32 29.72,43.28 33.53,47.09 v33.53,49.07 | v44.04,41.45 46.33,41.45 52.58,35.2 54.41,35.2 55.32,34.29 55.32,30.79 52.58,28.04 v52.58,26.37 | v26.67,22.71 26.06,23.32 26.06,24.08 FL_LOWER.43 | v32.61,22.71 32.61,22.4 v33.53,21.49
  Bottom 0.152: v14.78,47.09 15.85,47.09 16.76,48.01 21.03,48.01 v29.72,39.32 | v33.53,49.07 34.59,50.14 35.36,50.14 v44.04,41.45 | v52.58,26.37 52.58,24.99 51.51,23.93 48.92,23.93 | 48.92,23.93 46.79,23.93 PGM_OE_HL.1 45.26,22.86 44.2,21.79 39.47,21.79 39.17,21.49 v33.53,21.49 | v32.61,22.71 v26.67,22.71 | 48.92,23.93 48.92,20.12 45.72,16.92 45.72,16.61 PGM_EN.1
OEN_UPPER  (via drill 0.35)
  Top 0.152: PGM_EN.2 44.5,19.05 42.37,21.18 42.37,23.32 41.3,24.38 39.47,24.38 38.86,24.99 38.86,25.76 40.08,26.98 44.81,26.98 45.72,27.89 PGM_OE_HL.3 | v7.62,46.94 6.71,47.85 6.71,48.16 R6.1 | 24.84,48.92 v23.32,48.92 | 24.84,48.92 25.91,49.99 25.91,50.75 FL_UPPER.43 | v26.06,39.78 24.99,40.84 24.99,41.76 26.52,43.28 26.52,44.81 v25.91,45.42 | 24.84,48.92 v24.84,46.48
  Bottom 0.152: v7.62,46.94 13.26,46.94 14.94,48.62 23.01,48.62 v23.32,48.92 | v26.06,39.78 34.9,30.94 40.23,30.94 41.91,29.26 42.22,29.26 43.43,28.04 45.72,28.04 PGM_OE_HL.3 | v24.84,46.48 v25.91,45.42
ROM_ENABLE  (via drill 0.35)
  Top 0.152: v24.69,7.47 24.84,7.32 26.98,7.32 28.35,5.94 28.35,5.03 FL_LOWER.11 | v19.96,6.1 18.44,7.62 15.7,7.62 13.26,10.06 v13.26,11.89 16.31,14.94 19.51,14.94 19.96,15.39 v19.96,17.22 | v25.45,27.13 28.35,30.02 28.35,31.55 FL_UPPER.11
  Bottom 0.152: v24.69,7.47 24.69,7.01 23.77,6.1 v19.96,6.1 | v13.26,11.89 10.97,14.17 10.97,23.62 9.91,24.69 9.91,27.58 8.53,28.96 6.4,28.96 6.1,28.65 5.49,28.65 2.44,31.7 IC1.10 | v25.45,27.13 25.45,24.99 23.16,22.71 23.16,20.42 v19.96,17.22
SCK/PB2  (via drill 0.35)
  Top 0.152: v6.71,39.17 6.71,40.54 R2.2 | v10.52,33.68 14.94,29.26 14.94,23.16 | 14.94,23.16 14.02,22.25 13.56,22.25 U1.7 | v23.77,22.4 23.32,22.4 22.55,23.16 19.2,23.16 18.9,22.86 15.24,22.86 14.94,23.16
  Bottom 0.152: v6.71,39.17 10.52,35.36 v10.52,33.68 | v23.77,22.4 25.6,24.23 50.29,24.23 51.36,25.3 JP1.3
VCC  (via drill 0.35)
  Top 0.152: C1.1 11.11,17.53 | 11.11,17.53 11.11,21.91 12.7,23.49 U1.8 13.26,23.47 v13.26,24.38 | C5.1 28.35,54.56 28.35,52.27 28.96,51.66 28.96,50.9 FL_UPPER.37 28.96,50.75 28.96,49.38 19.36,39.78 19.36,39.01 18.75,38.41 13.72,38.41 | 13.72,38.41 13.72,40.54 R3.2 13.72,40.69 13.72,44.35 R5.2 13.56,44.5 13.56,44.96 11.89,46.63 11.89,48.16 R7.2 11.73,48.31 11.73,51.97 R9.2 11.73,52.12 10.97,52.12 10.06,53.03 9.45,53.03 8.53,52.12 R8.2 8.53,51.97 8.53,48.31 R6.2 8.53,48.16 8.53,44.5 R4.1 8.69,44.35 9.45,43.59 9.45,39.62 8.69,38.86 8.69,36.88 R1.2 8.53,36.73 8.53,34.14 v8.23,33.83 | 13.72,38.41 13.72,36.88 R10.2 | 11.12,26.67 11.12,29.72 C2.1 11.12,29.87 9.45,31.55 v9.45,32.61 | 11.12,26.67 C6.1 11.12,26.67 | 11.12,26.67 11.43,26.67 v12.5,25.6 | 11.73,11.43 11.73,6.1 12.65,5.18 TPVCC.TP | 11.73,11.43 C3.+ 11.73,11.43 | 11.73,11.43 14.63,14.33 14.63,17.22 14.33,17.53 11.12,17.53 11.11,17.53 | 28.96,30.63 28.96,31.55 FL_UPPER.12 | 28.96,30.63 28.96,30.17 28.35,29.57 28.35,28.04 C4.1 28.35,27.89 28.96,27.28 28.96,24.23 FL_LOWER.37 28.96,24.08 28.96,19.05 27.28,17.37 v27.28,10.36 | 28.96,30.63 29.72,30.63 29.87,30.79 29.87,31.55 FL_UPPER.14 | 29.87,4.12 29.72,3.96 29.11,3.96 28.96,4.12 28.96,4.88 FL_LOWER.12 28.96,5.03 28.96,5.79 26.82,7.93 v26.06,7.93 | 29.87,4.12 29.87,4.88 FL_LOWER.14 | v36.42,6.71 36.42,5.18 34.29,3.05 30.94,3.05 29.87,4.12
  Bottom 0.152: v12.5,25.6 12.5,25.15 v13.26,24.38 | v36.42,6.71 36.73,6.71 37.64,7.62 39.78,7.62 52.43,20.27 52.43,22.86 53.49,23.93 53.95,23.93 55.02,24.99 55.02,25.91 54.1,26.82 54.1,27.89 JP1.2 | v27.28,10.36 27.28,9.14 v26.06,7.93 23.62,5.49 18.59,5.49 17.83,6.25 IC1.21 17.68,6.25 15.24,6.25 14.17,5.18 12.8,5.18 TPVCC.TP | v9.45,32.61 v8.23,33.83
WEN_LOWER  (via drill 0.35)
  Top 0.152: v10.36,39.62 10.36,34.75 11.12,33.98 11.12,33.53 15.24,29.41 15.24,24.69 16.76,23.16 18.75,23.16 20.88,25.3 v22.25,25.3 25.15,25.3 25.45,24.99 25.45,24.23 FL_LOWER.44 | v6.4,45.87 6.4,46.63 5.79,47.24 5.79,51.21 6.55,51.97 R8.1 | v23.77,21.49 23.32,21.49 v22.25,22.55
  Bottom 0.152: v10.36,39.62 6.4,43.59 v6.4,45.87 | v23.77,21.49 26.06,23.77 35.97,23.77 36.88,22.86 40.54,22.86 PGM_WR_HL.1 | v22.25,25.3 v22.25,22.55
WEN_UPPER  (via drill 0.35)
  Top 0.152: v22.25,51.97 21.03,50.75 14.63,50.75 13.72,51.66 13.72,51.97 R9.1 | v24.84,52.27 25.45,51.66 25.45,50.9 FL_UPPER.44 | v37.19,36.27 38.25,35.2 38.25,31.09 40.54,28.8 40.54,28.04 PGM_WR_HL.3
  Bottom 0.152: v22.25,51.97 24.54,51.97 v24.84,52.27 27.74,49.38 27.74,44.65 36.12,36.27 v37.19,36.27

### Text on the board
Top: YAKS2-TITUO R02.1 / EmberHeavyIndustries 2018
Bottom: YAKS2-TITUO R02.1 / EmberHeavyIndustries 2018
tNames: 1 | 2 | ODD | EVEN